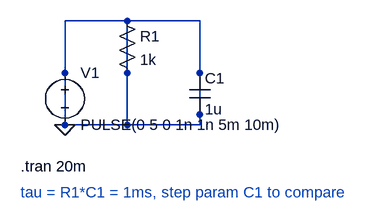
[diagram p0: schematic 02_RC_charge_discharge.asc]
02_RC_charge_discharge.asc, the LTspice schematic file:
Version 4
SHEET 1 880 680
WIRE 224 96 128 96
WIRE 336 96 224 96
WIRE 128 176 128 96
WIRE 224 176 224 96
WIRE 336 176 336 96
WIRE 128 256 128 176
WIRE 224 256 224 176
WIRE 224 256 128 256
WIRE 336 256 336 176
WIRE 336 256 224 256
FLAG 128 256 0
SYMBOL voltage 128 160 R0
SYMATTR InstName V1
SYMATTR Value PULSE(0 5 0 1n 1n 5m 10m)
SYMBOL res 208 80 R0
SYMATTR InstName R1
SYMATTR Value 1k
SYMBOL cap 320 176 R0
SYMATTR InstName C1
SYMATTR Value 1u
TEXT 60 320 Left 2 !.tran 20m
TEXT 60 360 Left 2 ;tau = R1*C1 = 1ms, step param C1 to compare

The netlist it stands for:
* 02_RC_charge_discharge.asc
V1 0 0 PULSE(0 5 0 1n 1n 5m 10m)
R1 0 0 1k
C1 0 0 1u
.tran 20m
* tau = R1*C1 = 1ms, step param C1 to compare
.backanno
.end